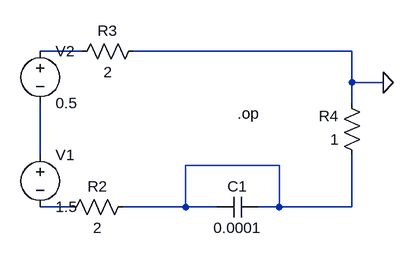
[diagram p0: schematic shortedCap.asc]
shortedCap.asc, the LTspice schematic file:
Version 4
SHEET 1 880 680
WIRE 32 112 -32 112
WIRE 448 112 112 112
WIRE 448 160 448 112
WIRE 496 160 448 160
WIRE 448 192 448 160
WIRE -32 272 -32 192
WIRE 336 288 192 288
WIRE 16 352 -32 352
WIRE 192 352 192 288
WIRE 192 352 96 352
WIRE 240 352 192 352
WIRE 336 352 336 288
WIRE 336 352 304 352
WIRE 448 352 448 272
WIRE 448 352 336 352
FLAG 496 160 0
SYMBOL res 112 336 R90
WINDOW 0 0 56 VBottom 2
WINDOW 3 32 56 VTop 2
SYMATTR InstName R2
SYMATTR Value 2
SYMBOL res 128 96 R90
WINDOW 0 0 56 VBottom 2
WINDOW 3 32 56 VTop 2
SYMATTR InstName R3
SYMATTR Value 2
SYMBOL res 464 288 R180
WINDOW 0 36 76 Left 2
WINDOW 3 36 40 Left 2
SYMATTR InstName R4
SYMATTR Value 1
SYMBOL cap 304 336 R90
WINDOW 0 0 32 VBottom 2
WINDOW 3 32 32 VTop 2
SYMATTR InstName C1
SYMATTR Value 0.0001
SYMBOL voltage -32 96 R0
SYMATTR InstName V2
SYMATTR Value 0.5
SYMBOL voltage -32 256 R0
SYMATTR InstName V1
SYMATTR Value 1.5
TEXT 272 208 Left 2 !.op

The netlist it stands for:
* shortedCap.asc
R2 N003 N004 2
R3 0 N001 2
R4 N003 0 1
C1 N003 N003 0.0001
V2 N001 N002 0.5
V1 N002 N004 1.5
.op
.backanno
.end